# EAGLE design listwa_z_czujnikami (EAGLE 7.6.0)
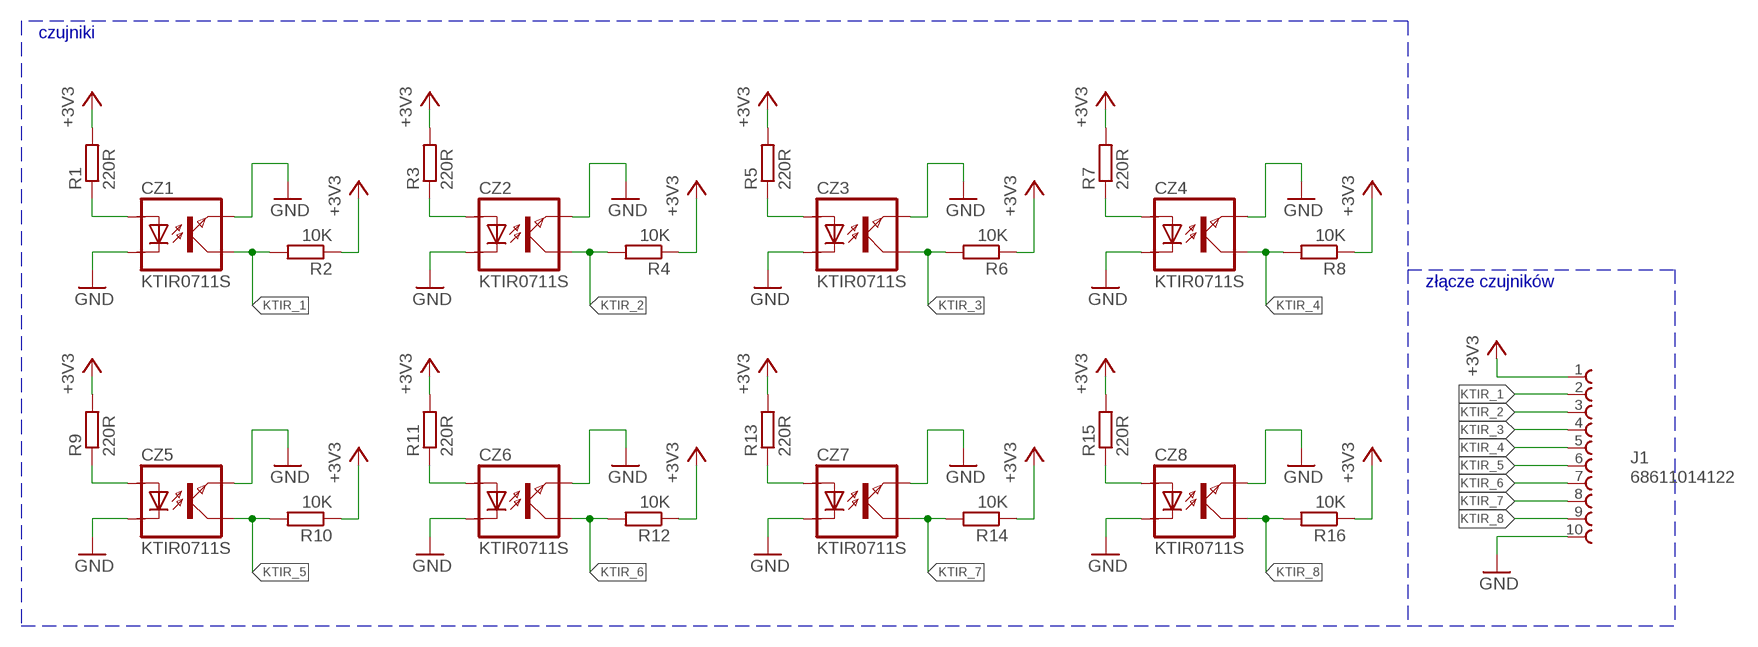
[diagram p0: schematic, sheet 1]

## Parts
CZ1  KTIR0711S  [TOP]
CZ2  KTIR0711S  [TOP]
CZ3  KTIR0711S  [TOP]
CZ4  KTIR0711S  [TOP]
CZ5  KTIR0711S  [TOP]
CZ6  KTIR0711S  [TOP]
CZ7  KTIR0711S  [TOP]
CZ8  KTIR0711S  [TOP]
J1  68611014122  [68611014122]
R1  220R  R-EU_R0805  [R0805]
R2  10K  R-EU_R0805  [R0805]
R3  220R  R-EU_R0805  [R0805]
R4  10K  R-EU_R0805  [R0805]
R5  220R  R-EU_R0805  [R0805]
R6  10K  R-EU_R0805  [R0805]
R7  220R  R-EU_R0805  [R0805]
R8  10K  R-EU_R0805  [R0805]
R9  220R  R-EU_R0805  [R0805]
R10  10K  R-EU_R0805  [R0805]
R11  220R  R-EU_R0805  [R0805]
R12  10K  R-EU_R0805  [R0805]
R13  220R  R-EU_R0805  [R0805]
R14  10K  R-EU_R0805  [R0805]
R15  220R  R-EU_R0805  [R0805]
R16  10K  R-EU_R0805  [R0805]

## Nets
+3V3: J1.1 R1.2 R2.1 R3.2 R4.1 R5.2 R6.1 R7.2 R8.1 R9.2 R10.1 R11.2 R12.1 R13.2 R14.1 R15.2 R16.1
GND: CZ1.EMITER CZ1.KATODA CZ2.EMITER CZ2.KATODA CZ3.EMITER CZ3.KATODA CZ4.EMITER CZ4.KATODA CZ5.EMITER CZ5.KATODA CZ6.EMITER CZ6.KATODA CZ7.EMITER CZ7.KATODA CZ8.EMITER CZ8.KATODA J1.10
KTIR_1: CZ1.KOLEKTOR J1.2 R2.2
KTIR_2: CZ2.KOLEKTOR J1.3 R4.2
KTIR_3: CZ3.KOLEKTOR J1.4 R6.2
KTIR_4: CZ4.KOLEKTOR J1.5 R8.2
KTIR_5: CZ5.KOLEKTOR J1.6 R10.2
KTIR_6: CZ6.KOLEKTOR J1.7 R12.2
KTIR_7: CZ7.KOLEKTOR J1.8 R14.2
KTIR_8: CZ8.KOLEKTOR J1.9 R16.2
N$1: CZ2.ANODA R3.1
N$2: CZ1.ANODA R1.1
N$3: CZ3.ANODA R5.1
N$4: CZ4.ANODA R7.1
N$5: CZ5.ANODA R9.1
N$6: CZ6.ANODA R11.1
N$7: CZ7.ANODA R13.1
N$8: CZ8.ANODA R15.1

## Buses
B$1

## Notes on the sheet
- czujniki
- złącze czujników

## Library data of the parts
CZ1-CZ8 = KTIR0711S:KTIR0711S
J1 = FPC_Connectors_Flat_Flexible_Cable_rev15c:68611014122: WR-FPC 1.00mm SMT ZIF Horizontal Top Contact, 10 Pins=>Code : Con_FPC_ZIF_1.00_68611014122 <http://katalog.we-online.de/media/images/eican/Con_FPC_ZIF_1.00_6861xx14122_pf2.jpg> Details see: http://katalog.we-online.de/en/em/686_1xx_141_22 Created 2014-07-09, Karrer Zheng 2014 (C) Würth Elektronik
R1-R16 = rcl:R-EU_: RESISTOR, European symbol

## Board
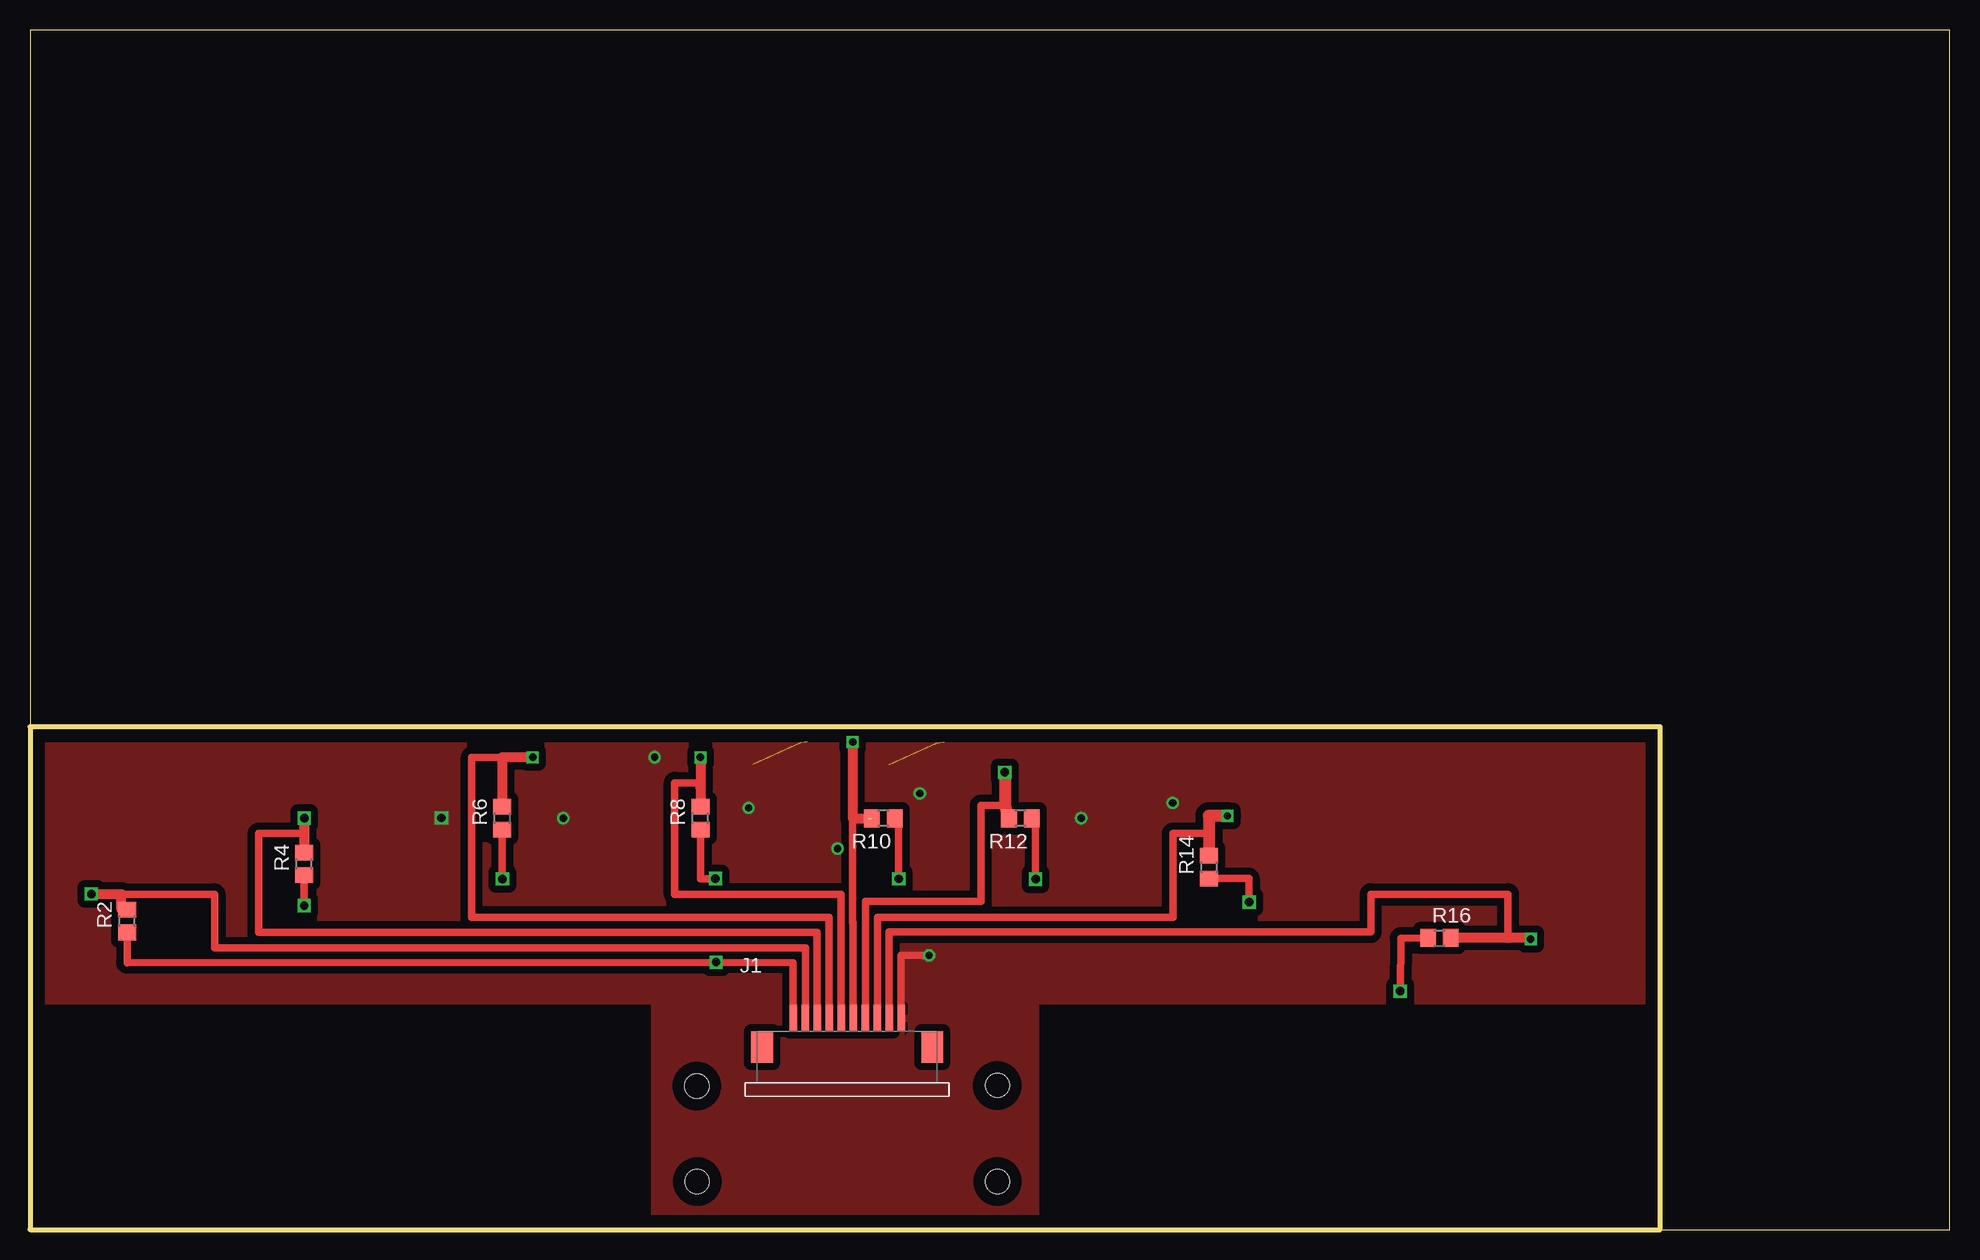
[diagram p1: board, top side]
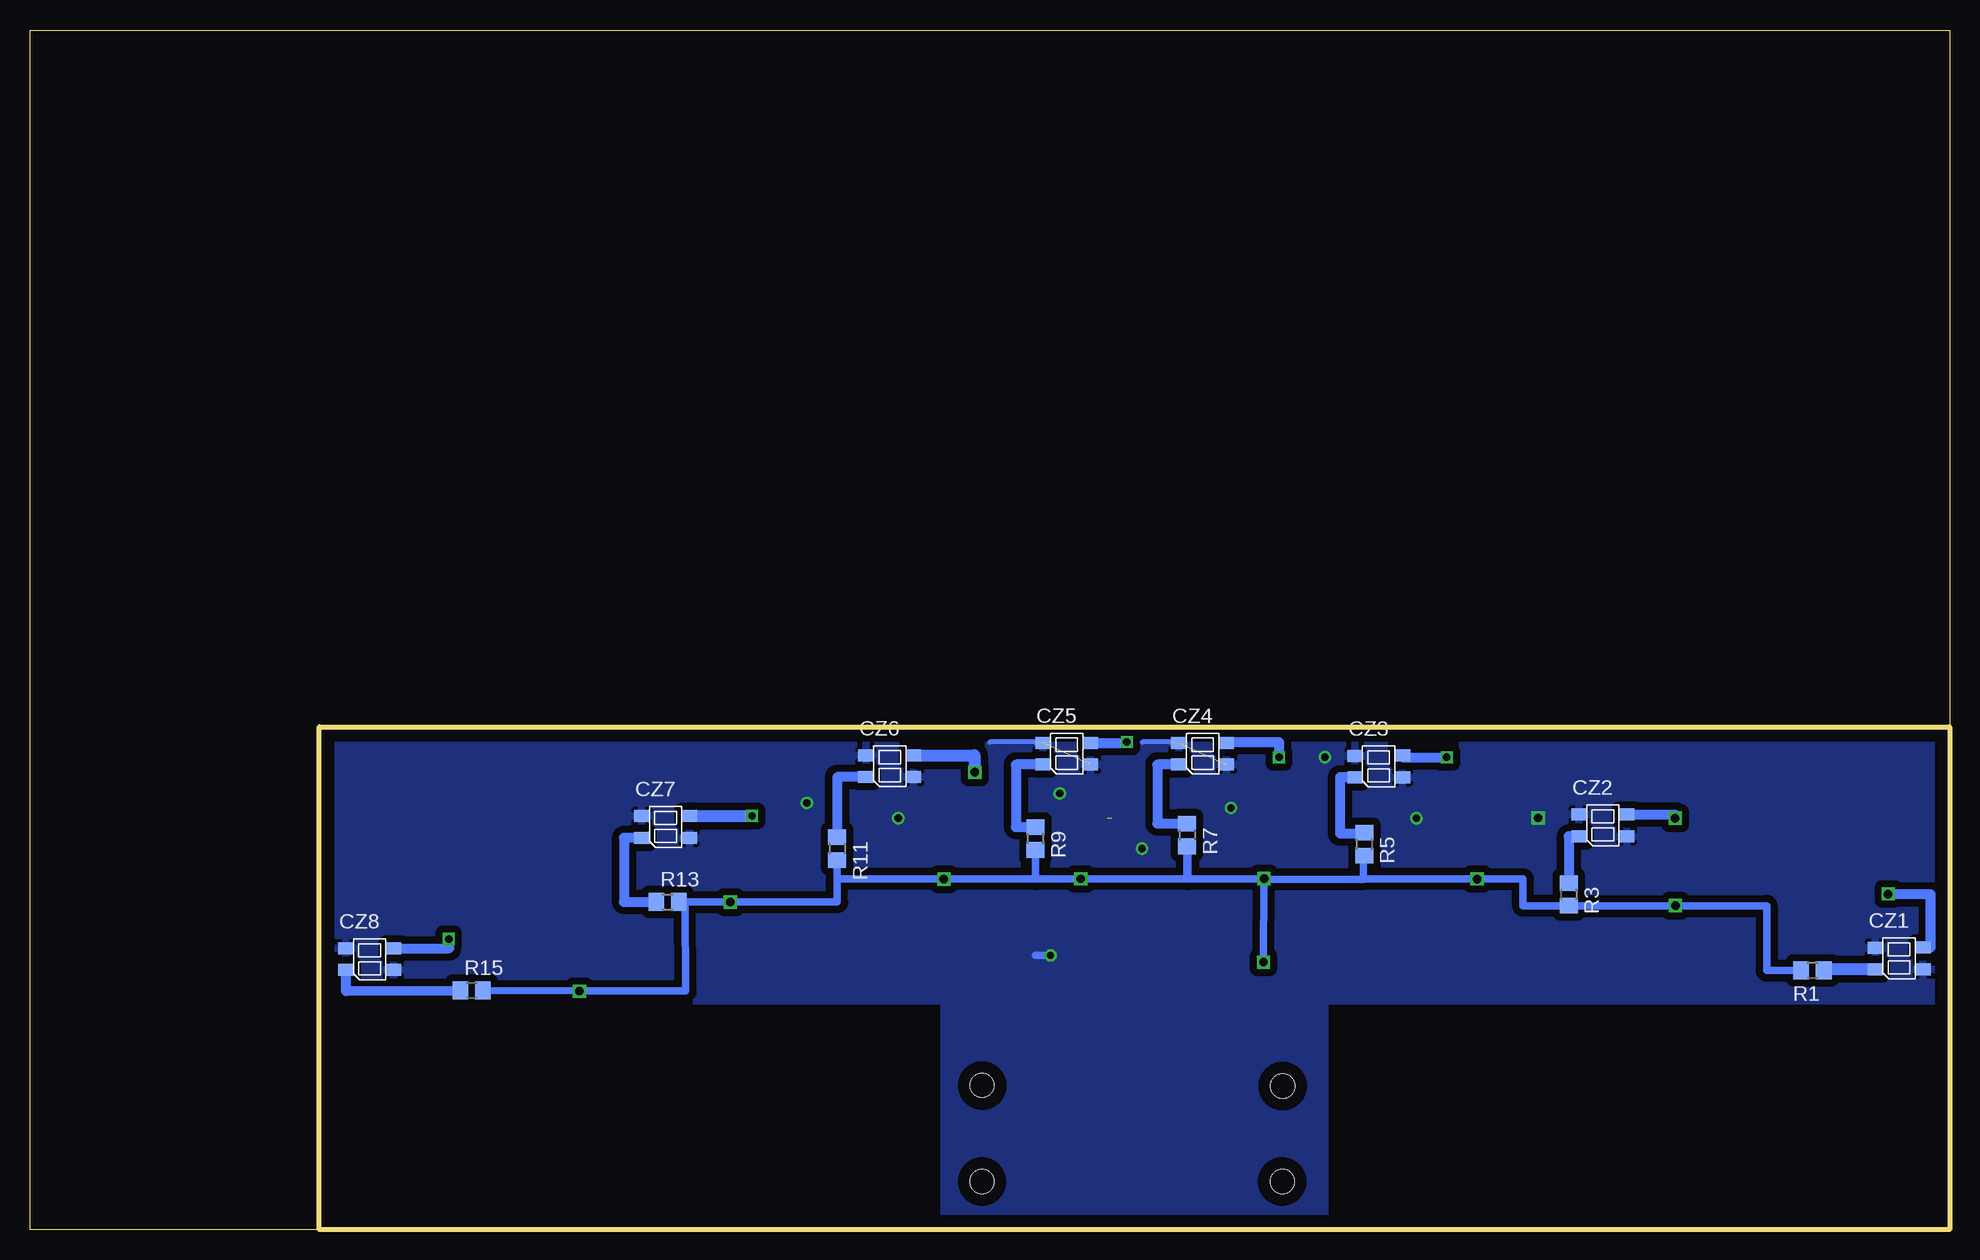
[diagram p2: board, bottom side, seen from below]

Size 160 x 100 mm. Coordinates in mm from the lower left corner, seen from the top.
Outline: 135.89,0 160,0 160,100 0,100 0,0
Outline: 0,0 135.89,0
Outline: 135.89,0 135.89,41.91 0,41.91 0,0
Copper layers (1*16): Top 0.035mm / dielectric 1.5mm / Bottom 0.035mm
Design rules "default": minimum track width 10mil, minimum drill 24mil, track to track 8mil, track to pad 8mil, pad to pad 8mil, via to via 8mil, smd to smd 8mil, copper to edge 40mil, drill to drill 8mil, minimum pad ring 10mil, minimum via ring 8mil, stop-mask expansion 4mil, vias tented up to drill 0mil, thermal gap 10mil
Holes 2 mm at 55.61,4 80.65,4 80.64,12.01 55.58,11.96

### Footprints (pad centres in the part's own frame; a part is rotated, then mirrored left to right if it is on the bottom)
TOP = smd 1.27 x 1: ANODA -1.985,-0.9; EMITER -1.985,0.9; KATODA 1.985,-0.9; KOLEKTOR 1.985,0.91
68611014122 = smd 0.6 x 2.2: 1 -7.5,1.1; 2 -6.5,1.1; 3 -5.5,1.1; 4 -4.5,1.1; 5 -3.5,1.1; 6 -2.5,1.1; 7 -1.5,1.1; 8 -0.5,1.1; 9 0.5,1.1; 10 1.5,1.1 | smd 1.8 x 2.6: Z1 -10.1,-1.3; Z2 4.1,-1.3
R0805 = smd 1.3 x 1.5: 1 -0.95,0; 2 0.95,0

### Placement (x,y rotation side)
CZ1  4.2,22.6 0 bottom
CZ2  28.9,33.69 0 bottom
CZ3  47.57,38.6 0 bottom
CZ4  62.26,39.66 0 bottom
CZ5  73.58,39.67 0 bottom
CZ6  88.34,38.62 0 bottom
CZ7  107.02,33.56 0 bottom
CZ8  131.69,22.53 0 bottom
J1  71.12,16.51 0 top
R1  11.43,21.59 180 bottom
R2  8.1,25.72 90 top
R3  31.75,27.94 270 bottom
R4  22.86,30.48 90 top
R5  48.79,32.13 270 bottom
R6  39.37,34.29 90 top
R7  63.55,32.89 270 bottom
R8  55.88,34.29 90 top
R9  76.2,32.6 270 bottom
R10  71.12,34.29 180 top
R11  92.71,31.75 270 bottom
R12  82.55,34.29 180 top
R13  106.85,27.3 0 bottom
R14  98.28,30.2 90 top
R15  123.19,19.93 0 bottom
R16  117.47,24.3 0 top

### Tracks (layer width: path | path; a pad name or v marks a point on that pad's centre or on a via)
+3V3  (via drill 0.6 pad 1.02, 0.7 pad 1.02)
  Top 0.61: R2.1 8.1,22.24 v57.2,22.29 63.62,22.25 J1.1 | R8.1 55.88,29.21 v57.15,29.21 | R4.1 v22.86,26.99 | R16.1 114.26,24.27 v114.22,19.89 | R10.1 72.39,34.29 v72.39,29.21 | R12.1 83.82,34.29 v83.82,29.21 | R14.1 101.6,29.25 v101.6,27.3 | R6.1 v39.37,29.21
  Bottom 0.61: v57.2,22.29 v57.15,29.21 | v57.15,29.21 63.5,29.21 | 63.5,29.21 63.55,29.21 | 63.55,29.21 R7.2 63.5,31.94 63.5,29.21 | R5.2 48.86,31.18 48.86,29.21 | v57.15,29.21 v57.15,29.2 48.86,29.2 48.86,29.21 | R1.2 15.24,21.59 15.24,26.99 v22.86,26.99 R3.2 35.56,26.99 35.56,29.21 v39.37,29.21 48.86,29.21 | 63.55,29.21 v72.39,29.21 76.2,29.21 | 76.2,29.21 v83.82,29.21 92.71,29.21 | 92.71,29.21 R11.2 | R13.2 105.41,27.3 | 105.41,27.3 v101.6,27.3 92.71,27.3 92.71,29.21 | R15.2 v114.22,19.89 105.34,19.88 105.41,27.3 | R9.2 76.2,29.21
GND  (via drill 0.6 pad 1.02, 0.7 pad 1.02)  (4 unrouted)
  Top 0.61: J1.10 72.62,22.86 v74.93,22.86
  Bottom 0.406: 64.77,40.64 67.31,40.64 | 76.2,40.64 80.01,40.64
  Bottom 0.61: v74.93,22.86 76.2,22.86
  other vias: 87.63,34.29 95.25,35.56 74.17,36.36 67.31,31.75 52.07,39.37 44.45,34.29 59.9,35.14 34.3,34.31
  pour Bottom (isolate 0.61): 1.27,43.18 134.62,41.91 134.62,19.05 83.82,19.05 83.82,1.27 52.07,1.27 52.07,19.05 1.27,19.05
  pour Top (isolate 0.61): 1.27,40.64 1.27,19.05 52.07,19.05 52.07,1.27 83.82,1.27 83.82,19.05 134.62,19.05 134.62,40.64
KTIR_1  (via drill 0.6)
  Top 0.61: J1.2 | 64.65,17.61 J1.2 | J1.2 64.63,23.47 15.38,23.47 15.38,27.94 7.62,27.94
  Top 0.813: v5.08,27.94 7.62,27.94 7.62,26.67 R2.2
  Bottom 0.813: CZ1.KOLEKTOR 1.57,23.51 1.57,27.94 v5.08,27.94
KTIR_2  (via drill 0.6, 0.7 pad 1.02)
  Top 0.61: J1.3 65.62,24.77 19.05,24.77 19.05,33.02 22.86,33.02
  Top 0.813: v22.86,34.29 22.86,33.02 R4.2
  Bottom 0.813: CZ2.KOLEKTOR 22.86,34.6 v22.86,34.29
KTIR_3  (via drill 0.6)
  Top 0.61: J1.4 66.62,26.02 36.83,26.02 36.83,39.37 39.37,39.37
  Top 0.813: v41.91,39.37 39.37,39.37 R6.2
  Bottom 0.813: CZ3.KOLEKTOR 45.59,39.37 v41.91,39.37
KTIR_4  (via drill 0.6)
  Top 0.61: J1.5 67.62,27.94 53.73,27.94 53.73,37.25 55.88,37.25 55.88,36.83
  Top 0.813: v55.88,39.37 55.88,36.83 R8.2
  Bottom 0.813: CZ4.KOLEKTOR 60.27,40.64 55.88,40.64 v55.88,39.37
KTIR_5  (via drill 0.6)  (1 unrouted)
  Top 0.61: J1.6 68.61,25.61 68.58,25.61 68.58,35.56
  Top 0.813: v68.58,40.64 68.58,35.56 68.58,34.29 69.85,34.29
  Bottom 0.813: CZ5.KOLEKTOR 68.58,40.58 v68.58,40.64
KTIR_6  (via drill 0.6 pad 1.02)
  Top 0.61: J1.7 69.65,27.34 79.27,27.35 79.25,35.35 81.28,35.35
  Top 1.016: v81.28,38.1 81.28,35.35 R12.2
  Bottom 1.016: CZ6.KOLEKTOR 81.28,39.53 v81.28,38.1
KTIR_7  (via drill 0.6)
  Top 0.61: J1.8 70.63,26.01 95.25,26.01 95.25,33.02 98.25,33.02
  Top 1.016: v99.82,34.48 98.25,34.48 98.25,33.02 R14.2
  Bottom 1.016: CZ7.KOLEKTOR v99.82,34.48
KTIR_8  (via drill 0.6)
  Top 0.61: J1.9 71.62,24.8 111.76,24.8 111.76,27.94 123.19,27.94 123.19,24.3
  Top 0.813: v125.09,24.21 125.09,24.3 123.19,24.3 R16.2
  Bottom 0.813: CZ8.KOLEKTOR 125.05,23.44 125.05,24.21 v125.09,24.21
N$1
  Bottom 0.813: CZ2.ANODA 31.75,32.79 R3.1
N$2
  Bottom 1.016: CZ1.ANODA 10.48,21.7 R1.1
N$3
  Bottom 0.813: CZ3.ANODA 50.8,37.7 50.8,33.02 48.79,33.02 R5.1
N$4
  Bottom 0.813: CZ4.ANODA 66.04,38.76 66.04,33.84 R7.1
N$5
  Bottom 0.813: CZ5.ANODA 77.83,38.77 77.83,33.55 R9.1
N$6
  Bottom 0.813: CZ6.ANODA 92.71,37.72 R11.1
N$7
  Bottom 0.813: CZ7.ANODA 110.49,32.66 110.49,27.3 R13.1
N$8
  Bottom 0.813: CZ8.ANODA 133.68,19.89 R15.1
N$10  (via drill 0.7 pad 1.02)
  other vias: 57.19,22.28
N$11  (via drill 0.7 pad 1.02)
  other vias: 57.14,29.24
N$12  (via drill 0.7 pad 1.02)
  other vias: 39.38,29.22
N$14  (via drill 0.7 pad 1.02)
  other vias: 22.85,27.01
N$15  (via drill 0.7 pad 1.02)
  other vias: 5.11,27.97
N$16  (via drill 0.7 pad 1.02)
  other vias: 72.42,29.23
N$17  (via drill 0.7 pad 1.02)
  other vias: 81.25,38.11
N$18  (via drill 0.7 pad 1.02)
  other vias: 101.62,27.3
N$19  (via drill 0.7 pad 1.02)
  other vias: 114.21,19.86